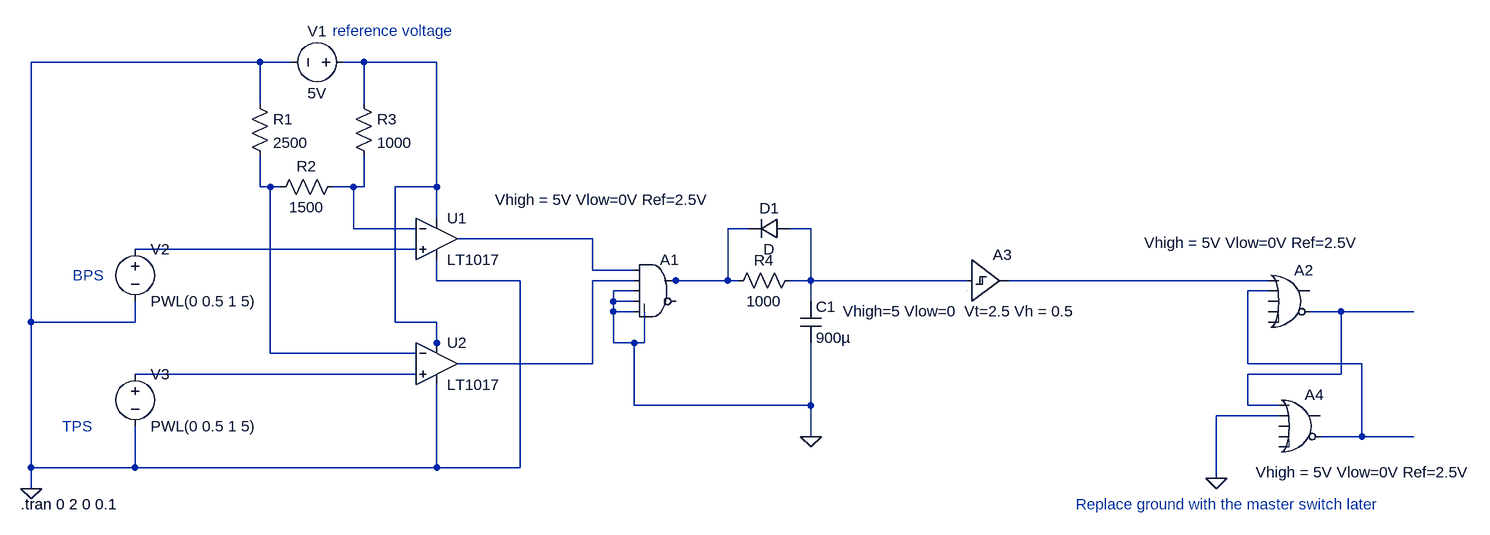
[diagram p0: schematic Draft3.asc]
Draft3.asc, the LTspice schematic file:
Version 4.1
SHEET 1 2128 680
WIRE 176 -144 -176 -144
WIRE 224 -144 176 -144
WIRE 336 -144 304 -144
WIRE 448 -144 336 -144
WIRE 176 -80 176 -144
WIRE 336 -80 336 -144
WIRE 176 48 176 0
WIRE 192 48 176 48
WIRE 208 48 192 48
WIRE 320 48 288 48
WIRE 336 48 336 0
WIRE 336 48 320 48
WIRE 448 48 448 -144
WIRE 448 48 384 48
WIRE 448 96 448 48
WIRE 320 112 320 48
WIRE 416 112 320 112
WIRE 928 112 896 112
WIRE 1024 112 992 112
WIRE 688 128 480 128
WIRE 416 144 -16 144
WIRE 688 176 688 128
WIRE 752 176 688 176
WIRE 448 192 448 160
WIRE 576 192 448 192
WIRE 752 192 688 192
WIRE 816 192 800 192
WIRE 896 192 896 112
WIRE 896 192 816 192
WIRE 912 192 896 192
WIRE 1024 192 1024 112
WIRE 1024 192 992 192
WIRE 1264 192 1024 192
WIRE 1728 192 1328 192
WIRE 752 208 720 208
WIRE 1728 208 1696 208
WIRE 720 224 720 208
WIRE 752 224 720 224
WIRE 1024 224 1024 192
WIRE 720 240 720 224
WIRE 752 240 720 240
WIRE 1840 240 1792 240
WIRE 1952 240 1840 240
WIRE -176 256 -176 -144
WIRE -16 256 -16 224
WIRE -16 256 -176 256
WIRE 384 256 384 48
WIRE 448 256 384 256
WIRE 448 288 448 256
WIRE 720 288 720 240
WIRE 752 288 720 288
WIRE 768 288 768 240
WIRE 768 288 752 288
WIRE 192 304 192 48
WIRE 416 304 192 304
WIRE 448 304 448 288
WIRE 688 320 688 192
WIRE 688 320 480 320
WIRE 1696 320 1696 208
WIRE 1872 320 1696 320
WIRE 416 336 -16 336
WIRE 1840 336 1840 240
WIRE 1840 336 1696 336
WIRE 752 384 752 288
WIRE 1024 384 1024 288
WIRE 1024 384 752 384
WIRE 1696 384 1696 336
WIRE 1744 384 1696 384
WIRE 1744 400 1648 400
WIRE 1024 432 1024 384
WIRE 1872 432 1872 320
WIRE 1872 432 1808 432
WIRE 1952 432 1872 432
WIRE -176 480 -176 256
WIRE -16 480 -16 416
WIRE -16 480 -176 480
WIRE 448 480 448 352
WIRE 448 480 -16 480
WIRE 576 480 576 192
WIRE 576 480 448 480
WIRE 1648 496 1648 400
WIRE -176 512 -176 480
FLAG -176 512 0
FLAG 1024 432 0
FLAG 1648 496 0
SYMBOL voltage 320 -144 R90
WINDOW 0 -32 56 VBottom 2
WINDOW 3 32 56 VTop 2
WINDOW 123 0 0 Left 0
WINDOW 39 0 0 Left 0
SYMATTR InstName V1
SYMATTR Value 5V
SYMBOL voltage -16 128 R0
WINDOW 123 0 0 Left 0
WINDOW 39 0 0 Left 0
SYMATTR InstName V2
SYMATTR Value PWL(0 0.5 1 5)
SYMBOL voltage -16 320 R0
WINDOW 123 0 0 Left 0
WINDOW 39 0 0 Left 0
SYMATTR InstName V3
SYMATTR Value PWL(0 0.5 1 5)
SYMBOL Comparators\\LT1017 448 128 R0
SYMATTR InstName U1
SYMBOL Comparators\\LT1017 448 320 R0
SYMATTR InstName U2
SYMBOL res 160 -96 R0
SYMATTR InstName R1
SYMATTR Value 2500
SYMBOL res 304 32 R90
WINDOW 0 0 56 VBottom 2
WINDOW 3 32 56 VTop 2
SYMATTR InstName R2
SYMATTR Value 1500
SYMBOL Digital\\and 784 144 R0
WINDOW 123 -246 -76 Left 2
SYMATTR Value2 Vhigh = 5V Vlow=0V Ref=2.5V
SYMATTR InstName A1
SYMBOL res 320 -96 R0
SYMATTR InstName R3
SYMATTR Value 1000
SYMBOL cap 1008 224 R0
WINDOW 3 24 56 Left 2
SYMATTR InstName C1
SYMATTR Value 900µ
SYMATTR Description Capacitor
SYMATTR Type cap
SYMATTR SpiceLine V=35 Irms=8.165 Rser=0.009 Lser=0 mfg="Vishay" pn="T54E6907M035" type="Tantalum Polymer"
SYMBOL res 1008 176 R90
WINDOW 0 0 56 VBottom 2
WINDOW 3 32 56 VTop 2
SYMATTR InstName R4
SYMATTR Value 1000
SYMBOL diode 992 96 R90
WINDOW 0 0 32 VBottom 2
WINDOW 3 32 32 VTop 2
SYMATTR InstName D1
SYMBOL Digital\\schmtbuf 1264 128 R0
WINDOW 3 -191 111 Left 2
SYMATTR InstName A3
SYMATTR Value Vhigh=5 Vlow=0  Vt=2.5 Vh = 0.5
SYMBOL Digital\\or 1760 160 R0
WINDOW 123 -223 -26 Left 2
SYMATTR InstName A2
SYMATTR Value2 Vhigh = 5V Vlow=0V Ref=2.5V
SYMBOL Digital\\or 1776 352 R0
WINDOW 123 -67 135 Left 2
SYMATTR InstName A4
SYMATTR Value2 Vhigh = 5V Vlow=0V Ref=2.5V
TEXT -112 184 Left 2 ;BPS
TEXT -128 416 Left 2 ;TPS
TEXT 288 -192 Left 2 ;reference voltage
TEXT -192 536 Left 2 !.tran 0 2 0 0.1
TEXT 1432 536 Left 2 ;Replace ground with the master switch later

The netlist it stands for:
* Draft3.asc
V1 N001 0 5V
V2 N007 0 PWL(0 0.5 1 5)
V3 N012 0 PWL(0 0.5 1 5)
X§U1 N007 N003 N001 0 N006 LT1017  ; pins In+ In- V+ V- OUT
X§U2 N012 N002 N001 0 N008 LT1017  ; pins In+ In- V+ V- OUT
R1 0 N002 2500
R2 N003 N002 1500
A1 N006 N008 0 0 0 0 N004 0 AND Vhigh = 5V Vlow=0V Ref=2.5V
R3 N001 N003 1000
C1 N005 0 900µ V=35 Irms=8.165 Rser=0.009 Lser=0 mfg="Vishay" pn="T54E6907M035" type="Tantalum Polymer"
R4 N005 N004 1000
D1 N005 N004 D
A3 N005 0 0 0 0 0 N009 0 SCHMITT Vhigh=5 Vlow=0  Vt=2.5 Vh = 0.5
A2 N009 N010 0 0 0 N011 0 0 OR Vhigh = 5V Vlow=0V Ref=2.5V
A4 N011 0 0 0 0 N010 0 0 OR Vhigh = 5V Vlow=0V Ref=2.5V
.model D D
.lib standard.dio
* BPS
* TPS
* reference voltage
.tran 0 2 0 0.1
* Replace ground with the master switch later
.backanno
.end